# Altium project RTC_Breakout_SP24.PrjPcb
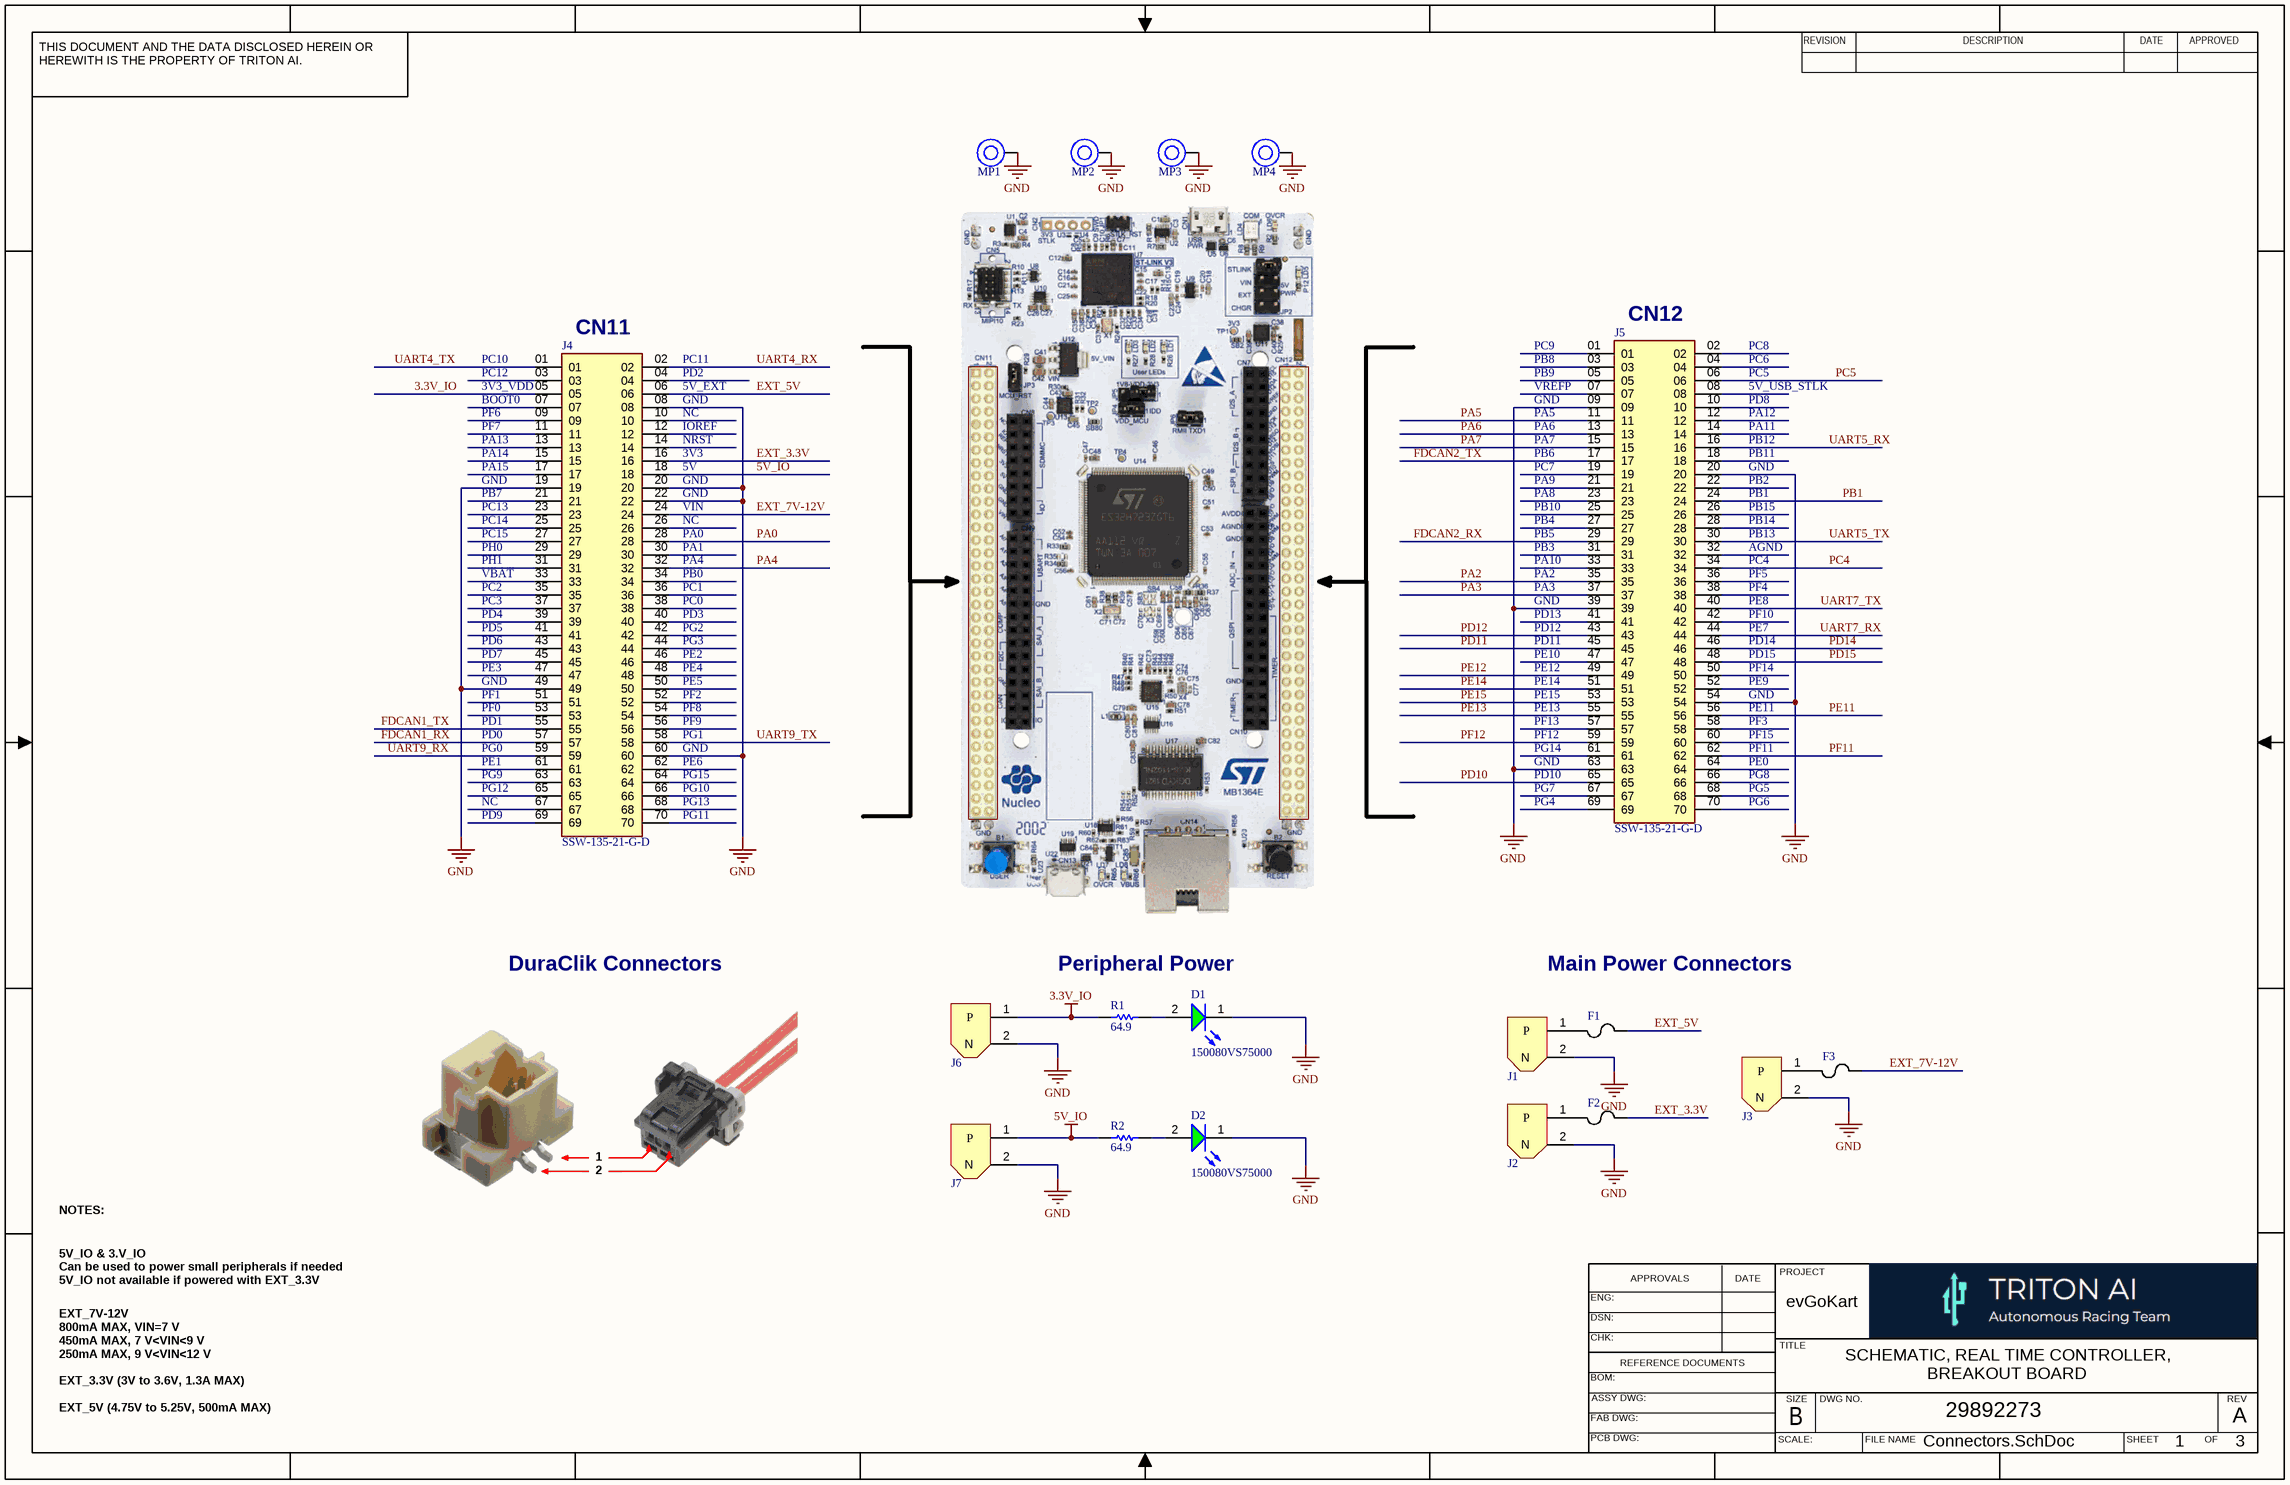
[diagram p0: Connectors.SchDoc]
3 sheets, 106 parts. Net scope: global (net labels, ports and power ports of the same name join across sheets).
Board file: RTC_Breakout_SP24.PcbDoc
Sheets:
  Connectors.SchDoc
  CAN_RS232.SchDoc
  I-O Connectors.SchDoc

## Sheet Connectors.SchDoc
size 431 x 279 mm; DrawnBy: Frank Chaqueco; Organization: ORGANIZATION; Address1: ADDRESS 1; Address2: ADDRESS 2; Address3: ADDRESS 3; Address4: ADDRESS 4; Revision: -; SheetNumber: 1; SheetTotal: 3; ENG_APP_DATE: --/--/--; DSN_APP_DATE: --/--/--; CHK_APP_DATE: --/--/--

### Parts
D1  150080VS75000  [WL-SMCW_0805_150080xx75000]
D2  150080VS75000  [WL-SMCW_0805_150080xx75000]
F1  500mA  [FUS_VISHAY_MFU0805_VIS]  (value not drawn)
F2  1.5A  [FUS_VISHAY_MFU0805_VIS]  (value not drawn)
F3  800mA  [FUS_VISHAY_MFU0805_VIS]  (value not drawn)
J1  XT30UPB-M  [XT30UPB-M]  (value not drawn)
J2  XT30UPB-M  [XT30UPB-M]  (value not drawn)
J3  XT30UPB-M  [XT30UPB-M]  (value not drawn)
J4  SSW-135-21-G-D  [SAMTEC_SSW-135-21-G-D]
J5  SSW-135-21-G-D  [SAMTEC_SSW-135-21-G-D]
J6  XT30UPB-M  [XT30UPB-M]  (value not drawn)
J7  XT30UPB-M  [XT30UPB-M]  (value not drawn)
MP1  M2.5 x 9mm  [9774090151]  (value not drawn)
MP2  M2.5 x 9mm  [9774090151]  (value not drawn)
MP3  M2.5 x 9mm  [9774090151]  (value not drawn)
MP4  M2.5 x 9mm  [9774090151]  (value not drawn)
R1  64.9  [RESC2013X60X35LL10T20]
R2  64.9  [RESC2013X60X35LL10T20]

### Nets
3.3V_IO: J4.05 J6.1(P) R1.2
5V_IO: J4.18 J7.1(P) R2.2
GND: D1.1(K) D2.1(K) J1.2(N) J2.2(N) J3.2(N) J4.08 J4.19 J4.20 J4.22 J4.49 J4.60 J5.09 J5.20 J5.39 J5.54 J5.63 J6.2(N) J7.2(N) MP1.1 MP2.1 MP3.1 MP4.1
EXT_3.3V: F2.1 J4.16
EXT_5V: F1.1 J4.06
EXT_7V-12V: F3.1 J4.24
FDCAN1_RX: J4.57
FDCAN1_TX: J4.55
FDCAN2_RX: J5.29
FDCAN2_TX: J5.17
PA0: J4.28
PA2: J5.35
PA3: J5.37
PA4: J4.32
PA5: J5.11
PA6: J5.13
PA7: J5.15
PB1: J5.24
PC4: J5.34
PC5: J5.06
PD10: J5.65
PD11: J5.45
PD12: J5.43
PD14: J5.46
PD15: J5.48
PE11: J5.56
PE12: J5.49
PE13: J5.55
PE14: J5.51
PE15: J5.53
PF11: J5.62
PF12: J5.59
UART4_RX: J4.02
UART4_TX: J4.01
UART5_RX: J5.16
UART5_TX: J5.30
UART7_RX: J5.44
UART7_TX: J5.40
UART9_RX: J4.59
UART9_TX: J4.58
NetD1_2: D1.2(A) R1.1
NetD2_2: D2.2(A) R2.1
NetF1_2: F1.2 J1.1(P)
NetF2_2: F2.2 J2.1(P)
NetF3_2: F3.2 J3.1(P)

Not connected (* = marked no-connect by the designer): J4 03 04 07 09 10 11 12 13 14 15 17 21 23 25 26 27 29 30 31 33 34 35 36 37 38 39 40 41 42 43 44 45 46 47 48 50 51 52 53 54 56 61 62 63 64 65 66 67 68 69 70; J5 01 02 03 04 05 07 08 10 12 14 18 19 21 22 23 25 26 27 28 31 32 33 36 38 41 42 47 50 52 57 58 60 61 64 66 67 68 69 70

### Notes on the sheet
- PC10
- (near J4) CN11
- (near J4) PC11
- PC9
- PB8
- (near J5) CN12
- PC8
- PC6
- PC12
- (near J4) 3V3_VDD
- (near J4) BOOT0
- PF6
- PF7
- (near J4) PD2
- (near J4) 5V_EXT
- (near J4) GND
- (near J4) NC
- (near J4) IOREF
- PB9
- (near J5) VREFP
- GND
- PA5
- PA6
- PC5
- 5V_USB_STLK
- PD8
- PA12
- PA11
- PA13
- PA14
- PA15
- PB7
- (near J4) NRST
- (near J4) 3V3
- (near J4) 5V
- PA7
- PB6
- PC7
- PA9
- PA8
- PB12
- PB11
- PB2
- PB1
- PC13
- PC14
- PC15
- PH0
- PH1
- (near J4) VIN
- (near J4) PA0
- (near J4) PA1
- (near J4) PA4
- PB10
- PB4
- PB5
- PB3
- PA10
- PB15
- PB14
- PB13
- AGND
- PC4
- VBAT
- PC2
- PC3
- PD4
- PD5
- (near J4) PB0
- (near J4) PC1
- (near J4) PC0
- (near J4) PD3
- (near J4) PG2
- PA2
- PA3
- PD13
- PD12
- PF5
- PF4
- PE8
- PF10
- PE7
- PD6
- PD7
- PE3
- PF1
- (near J4) PG3
- (near J4) PE2
- (near J4) PE4
- (near J4) PE5
- (near J4) PF2
- PD11
- PE10
- PE12
- PE14
- PE15
- PD14
- PD15
- PF14
- PE9
- PF0
- PG0
- PE1
- PD1
- PD0
- (near J4) PF8
- (near J4) PF9
- (near J4) PG1
- (near J4) PE6
- PE13
- PF13
- PF12
- PG14
- PE11
- PF3
- PF15
- PF11
- PE0
- PG9
- PG12
- NC
- PD9
- (near J4) PG15
- (near J4) PG10
- (near J4) PG13
- (near J4) PG11
- PD10
- PG7
- PG4
- PG8
- PG5
- PG6
- DuraClik Connectors
- Peripheral Power
- Main Power Connectors
- 1
- NOTES:
- 2
- 5V_IO & 3.V_IO
  Can be used to power small peripherals if needed
  5V_IO not available if powered with EXT_3.3V
- evGoKart
- SCHEMATIC, REAL TIME CONTROLLER,
- EXT_7V-12V
  800mA MAX, VIN=7 V
  450mA MAX, 7 V<VIN<9 V
  250mA MAX, 9 V<VIN<12 V
  EXT_3.3V (3V to 3.6V, 1.3A MAX)
  EXT_5V (4.75V to 5.25V, 500mA MAX)
- BREAKOUT BOARD
- 29892273
- A
- Connectors.SchDoc
- 3
- THIS DOCUMENT AND THE DATA DISCLOSED HEREIN OR HEREWITH IS THE PROPERTY OF TRITON AI.
- REVISION
- DESCRIPTION
- DATE
- APPROVED
- ENG:
- APPROVALS
- PROJECT
- DSN:
- CHK:
- REFERENCE DOCUMENTS
- TITLE
- BOM:
- FAB DWG:
- PCB DWG:
- ASSY DWG:
- SCALE:
- SIZE
- B
- DWG NO.
- FILE NAME
- SHEET
- OF
- REV

### Library data of the parts
D1 D2 = CMP-1426-00009-6: WL-SMCW SMT Mono-Color Chip LED Waterclear; Max Junction Temperature (Tj): 95°C; Max Reverse Voltage (DC): 5V; Luminous Intensity: 40mcd; Color: Green; Peak Wavelength: 572nm; Wavelength: 570nm; Viewing Angle: 140°; Power Dissipation: 72mW; Forward Current: 100mA; Test Current: 20mA; Forward Voltage: 2V; Lens Style: Clear, Rectangular; Reverse Voltage: 5V; Length: 2mm; RoHS: Compliant; Min Operating Temperature: -40°C; REACH SVHC: Unknown; Packaging: Tape and Reel; Case/Package: 0805; Max Operating Temperature: 85°C; Case Code (Metric): 2012; Width: 1.25mm; Dominant Wavelength: 570nm; Mount: Surface Mount; Case Code (Imperial): 0805; Height: 700µm
F1 = MFU0805FF00500P500: Mfr_Name: Vishay; Current Rating: 500mA
F2 = MFU0805FF01500P100: Mfr_Name: Vishay; Current Rating: 1.5A
F3 = MFU0805FF00800P100: Mfr_Name: Vishay; Current Rating: 800mA
J1-J3 J6 J7 = XT30UPB-M: Socket; DC supply; XT30; male; PIN: 2; on PCBs; THT; yellow; 15A; 500V; MF: amass; MP: XT30UPB-M; Value: *; SnapEDA_Link: https://www.snapeda.com/parts/XT30UPB-M/AMASS/view-part/?ref=snap; Price: None; Package: None; Check_prices: https://www.snapeda.com/parts/XT30UPB-M/AMASS/view-part/?ref=eda; Availability: Not in stock
J4 J5 = SSW-135-21-G-D: MF: {'manufacturer': u'Samtec Inc.'}; Package: None; Price: None; Value: *; MP: SSW-135-21-G-D; Availability: Unavailable
MP1-MP4 = 9774090151R: WA-SMSI SMT Steel Spacer with internal Thread, OD 5.1mm, M2.5 x 9mm; Manufacturer: Wurth Elektronik; Inside Diameter: 3.5mm; Surface: Tin; ComponentLink1Description: Website Link; ComponentLink1URL: https://www.we-online.com/redexpert/article/9774090151R?ad; ComponentLink2Description: Datasheet Link; ComponentLink2URL: https://www.we-online.com/redexpert/spec/9774090151R?ad; Manufacturer Part Number: 9774090151R; Category: SMT Spacers; Match Code: WA-SMSI; Mount: Surface Mount; Operating Temperature Max: 150°C; Operating Temperature Min: -55°C; Packaging: Tape and Reel; Height: 9mm; Material: Steel; Outside Diameter: 5.1mm; Thread Size: M2.5
R1 R2 = CMP-2001-01223-1: Part Number: RC0805FR-0764R9L; Manufacturer: Yageo

## Sheet CAN_RS232.SchDoc
size 431 x 279 mm; SheetNumber: 2; SheetTotal: 3
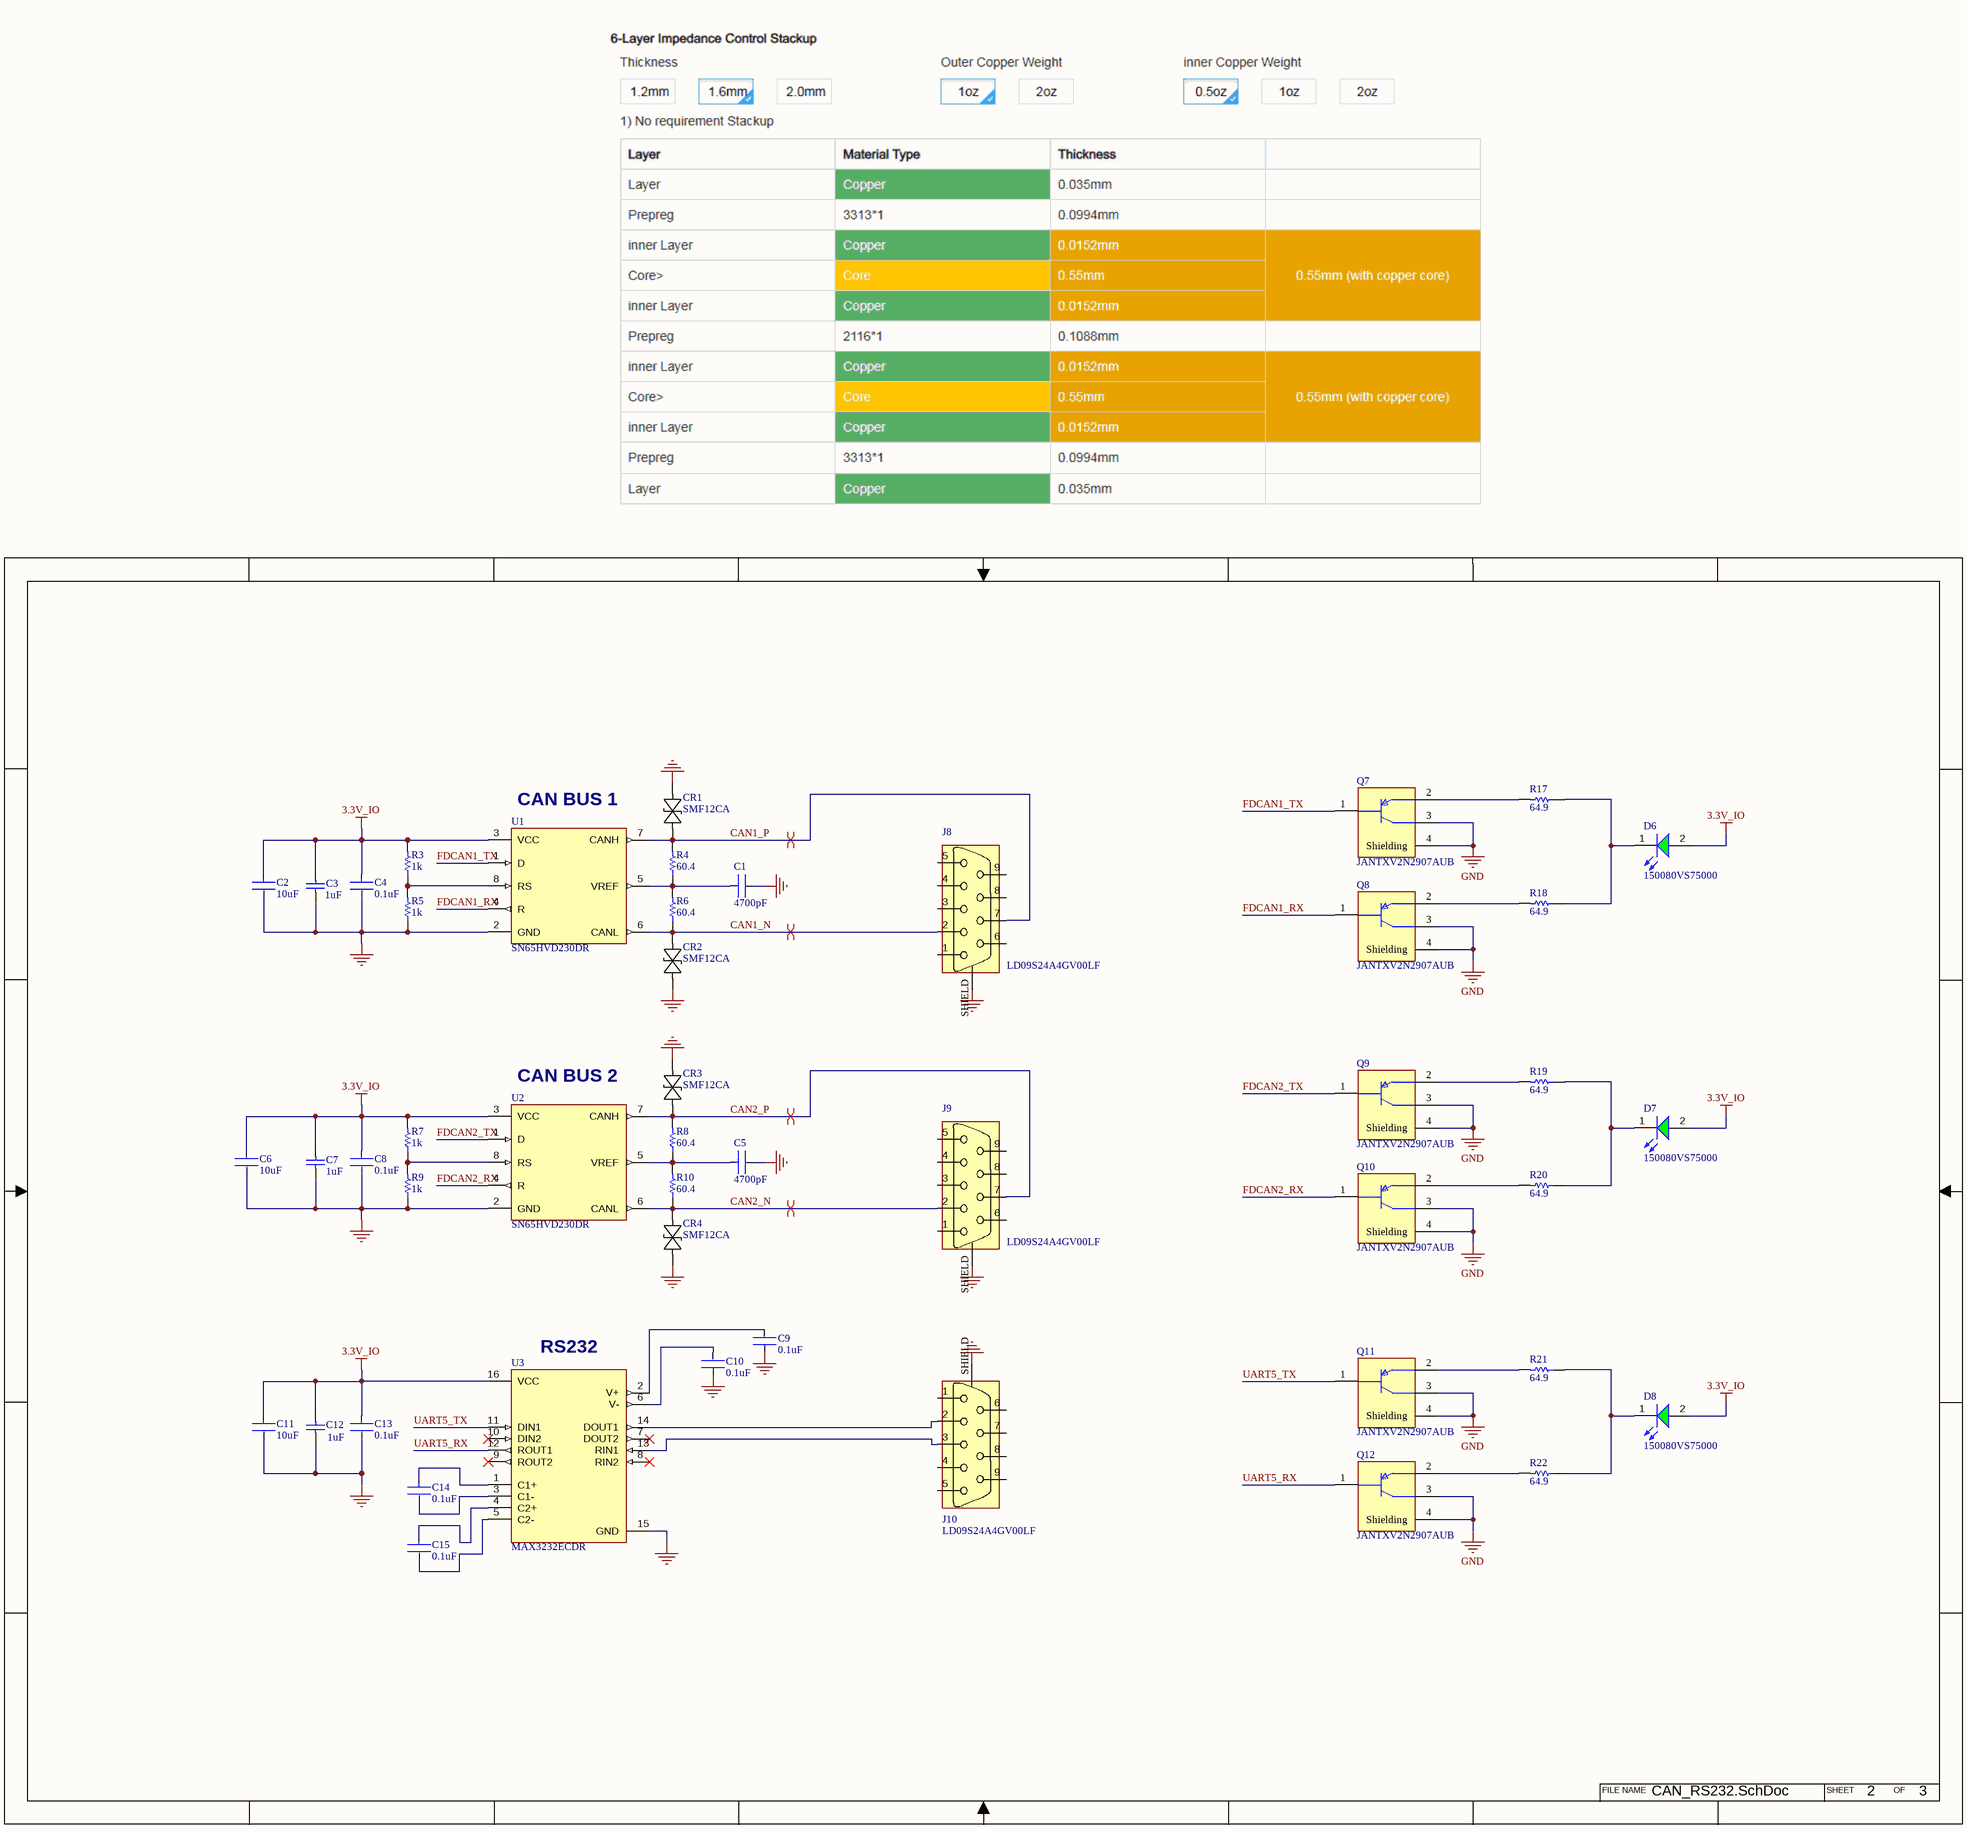
[diagram p1: CAN_RS232.SchDoc]

### Parts
C1  4700pF  [FP-CC0805-0_85-MFG]
C2  10uF  [FP-CL31-IPC_B]
C3  1uF  [CAPC2013X100X50ML20T25]
C4  0.1uF  [FP-CC0805-0_85-MFG]
C5  4700pF  [FP-CC0805-0_85-MFG]
C6  10uF  [FP-CL31-IPC_B]
C7  1uF  [CAPC2013X100X50ML20T25]
C8  0.1uF  [FP-CC0805-0_85-MFG]
C9  0.1uF  [FP-CC0805-0_85-MFG]
C10  0.1uF  [FP-CC0805-0_85-MFG]
C11  10uF  [FP-CL31-IPC_B]
C12  1uF  [CAPC2013X100X50ML20T25]
C13  0.1uF  [FP-CC0805-0_85-MFG]
C14  0.1uF  [FP-CC0805-0_85-MFG]
C15  0.1uF  [FP-CC0805-0_85-MFG]
CR1  SMF12CA  [SOD-123F_LTF]
CR2  SMF12CA  [SOD-123F_LTF]
CR3  SMF12CA  [SOD-123F_LTF]
CR4  SMF12CA  [SOD-123F_LTF]
D6  150080VS75000  [WL-SMCW_0805_150080xx75000]
D7  150080VS75000  [WL-SMCW_0805_150080xx75000]
D8  150080VS75000  [WL-SMCW_0805_150080xx75000]
J8  LD09S24A4GV00LF  [ASSMANN_A-DF09A/KG-T2S]
J9  LD09S24A4GV00LF  [ASSMANN_A-DF09A/KG-T2S]
J10  LD09S24A4GV00LF  [ASSMANN_A-DF09A/KG-T2S]
Q7  JANTXV2N2907AUB  [FP-UB-IPC_C]
Q8  JANTXV2N2907AUB  [FP-UB-IPC_C]
Q9  JANTXV2N2907AUB  [FP-UB-IPC_C]
Q10  JANTXV2N2907AUB  [FP-UB-IPC_C]
Q11  JANTXV2N2907AUB  [FP-UB-IPC_C]
Q12  JANTXV2N2907AUB  [FP-UB-IPC_C]
R3  1k  [RESC2013X60X35ML10T20]
R4  60.4  [RESC2013X60X35LL10T20]
R5  1k  [RESC2013X60X35ML10T20]
R6  60.4  [RESC2013X60X35LL10T20]
R7  1k  [RESC2013X60X35ML10T20]
R8  60.4  [RESC2013X60X35LL10T20]
R9  1k  [RESC2013X60X35ML10T20]
R10  60.4  [RESC2013X60X35LL10T20]
R17  64.9  [RESC2013X60X35LL10T20]
R18  64.9  [RESC2013X60X35LL10T20]
R19  64.9  [RESC2013X60X35LL10T20]
R20  64.9  [RESC2013X60X35LL10T20]
R21  64.9  [RESC2013X60X35LL10T20]
R22  64.9  [RESC2013X60X35LL10T20]
U1  SN65HVD230DR  [SOIC127P599X175-8N]
U2  SN65HVD230DR  [SOIC127P599X175-8N]
U3  MAX3232ECDR  [SOIC127P600X175-16N]

### Nets
3.3V_IO: C2.1 C3.2 C4.1 C6.1 C7.2 C8.1 C11.1 C12.2 C13.1 D6.2(A) D7.2(A) D8.2(A) R3.2 R7.2 U1.3(VCC) U2.3(VCC) U3.16(VCC)
GND: C1.2 C2.2 C3.1 C4.2 C5.2 C6.2 C7.1 C8.2 C9.1 C10.1 C11.2 C12.1 C13.2 CR1.1 CR2.1 CR3.2 CR4.2 J8.SHIELD J9.SHIELD J10.SHIELD Q7.3(C) Q7.4(Shielding) Q8.3(C) Q8.4(Shielding) Q9.3(C) Q9.4(Shielding) Q10.3(C) Q10.4(Shielding) Q11.3(C) Q11.4(Shielding) Q12.3(C) Q12.4(Shielding) R5.1 R9.1 U1.2(GND) U2.2(GND) U3.15(GND)
CAN1_N: CR2.2 J8.2 R6.1 U1.6(CANL)
CAN1_P: CR1.2 J8.7 R4.2 U1.7(CANH)
CAN2_N: CR4.1 J9.2 R10.1 U2.6(CANL)
CAN2_P: CR3.1 J9.7 R8.2 U2.7(CANH)
FDCAN1_RX: Q8.1(B) U1.4(R)
FDCAN1_TX: Q7.1(B) U1.1(D)
FDCAN2_RX: Q10.1(B) U2.4(R)
FDCAN2_TX: Q9.1(B) U2.1(D)
UART5_RX: Q12.1(B) U3.12(ROUT1)
UART5_TX: Q11.1(B) U3.11(DIN1)
NetC1_1: C1.1 R4.1 R6.2 U1.5(VREF)
NetC5_1: C5.1 R8.1 R10.2 U2.5(VREF)
NetC9_2: C9.2 U3.2(V+)
NetC10_2: C10.2 U3.6(V-)
NetC14_1: C14.1 U3.1(C1+)
NetC14_2: C14.2 U3.3(C1-)
NetC15_1: C15.1 U3.4(C2+)
NetC15_2: C15.2 U3.5(C2-)
NetD6_1: D6.1(K) R17.1 R18.1
NetD7_1: D7.1(K) R19.1 R20.1
NetD8_1: D8.1(K) R21.1 R22.1
NetJ10_2: J10.2 U3.14(DOUT1)
NetJ10_3: J10.3 U3.13(RIN1)
NetQ7_2: Q7.2(E) R17.2
NetQ8_2: Q8.2(E) R18.2
NetQ9_2: Q9.2(E) R19.2
NetQ10_2: Q10.2(E) R20.2
NetQ11_2: Q11.2(E) R21.2
NetQ12_2: Q12.2(E) R22.2
NetR3_1: R3.1 R5.2 U1.8(RS)
NetR7_1: R7.1 R9.2 U2.8(RS)

Not connected (* = marked no-connect by the designer): J8 1 3 4 5 6 8 9; J9 1 3 4 5 6 8 9; J10 1 4 5 6 7 8 9; U3 7(DOUT2)* 8(RIN2)* 9(ROUT2)* 10(DIN2)*

### Layout directives
differential pair: CAN1_N, CAN1_P, CAN2_N, CAN2_P

### Notes on the sheet
- (near U1) CAN BUS 1
- (near U2) CAN BUS 2
- (near U3) RS232
- CAN_RS232.SchDoc
- 2
- 3
- FILE NAME
- SHEET
- OF

### Library data of the parts
C1 C5 = CMP-1036-03591-2: CAP CER 4700PF 50V X7R 0805; Manufacturer: Yageo; Manufacturer Part Number: CC0805KRX7R9BB472; Tolerance: 0.1; Capacitance: 4.7 nF; Value: 4.7 nF; Material: Ceramic; Device Class L1: Passive Components; Voltage Rating: 50 V; ComponentLink2URL: http://www.yageo.com/documents/recent/UPY-GPHC_Y5V_6.3V-to-50V_8.pdf; Device Class L3: Ceramic Capacitors; Temperature: -30°C to +85°C; Height: 0.95mm; Package: CC0805-0.85; Digikey Description: CAP CER 4700PF 50V X7R 0805; Ipc Land Pattern Name: CAPC200125X85; Device Class L2: Capacitors; Temperature Range High: +85°C; Mouser Description: Multilayer Ceramic Capacitors MLCC - SMD/SMT 4.7nF 50V X7R 10%; Lead Free: Yes; Category: Cap; Temperature Range Low: -30°C; Octopart: https://octopart.com/cc0805krx7r9bb472-yageo-192986; Automotive: No; RoHS: TRUE; Temperature Characteristic: X7R; ComponentLink2Description: Datasheet; Footprint Url: http://www.yageo.com/exep/pages/download/literatures/UPY-C_GEN_24.pdf
C2 C6 C11 = CMP-13271-001434-1: Cap Ceramic 10uF 25V X7R ±10% SMD 1206 +125°C Embossed T/R; Max Operating Temperature: 125°C; Dielectric: X7R; Voltage Rating: 25V; Tolerance: 10%; Min Operating Temperature: -55°C; Height: 1.6mm; Mount: Surface Mount; Width: 0.063inch; Thickness: 0.071inch; Case Code (Metric): 3216; Contact Plating: Tin; Packaging: Tape and Reel; Case/Package: 1206; Value: 10uF; Case Code (Imperial): 1206; Length: 0.126inch; Radiation Hardening: No; Package Quantity: 1; Depth: 1.6mm
C3 = CMP-2007-03676-1: C0805C105K8RACTU; Manufacturer: Kemet; Part Number: C0805C105K8RACTU
C4 C8-C10 C13-C15 = CMP-2100-03606-3: CAP CER 0.1UF 50V X7R 0805; Manufacturer Part Number: CC0805KRX7R9BB104; Manufacturer: Yageo; Tolerance: 0.1; Capacitance: 100 nF; Value: 100 nF; Material: Ceramic; Device Class L1: Passive Components; ComponentLink2Description: Datasheet; Package: CC0805-0.85; Digikey Description: CAP CER 0.1UF 50V X7R 0805; Device Class L3: Ceramic Capacitors; Temperature: -30°C to +85°C; Temperature Characteristic: X7R; Voltage Rating: 50 V; Height: 0.95mm; RoHS: TRUE; Ipc Land Pattern Name: CAPC200125X85; Device Class L2: Capacitors; Category: Cap; Temperature Range Low: -30°C; Temperature Range High: +85°C; Mouser Description: Multilayer Ceramic Capacitors MLCC - SMD/SMT 100nF 50V X7R 10%; Footprint Url: http://www.yageo.com/exep/pages/download/literatures/UPY-C_GEN_24.pdf; Automotive: No; Octopart: https://octopart.com/cc0805krx7r9bb104-yageo-192993; Lead Free: Yes; ComponentLink2URL: http://www.yageo.com/documents/recent/UPY-GPHC_Y5V_6.3V-to-50V_8.pdf
C7 C12 = CMP-2007-03676-1: Part Number: C0805C105K8RACTU; Manufacturer: Kemet
CR1-CR4 = SMF12CA: No Description Available; Mfr_Name: Littelfuse Inc
D6-D8 = CMP-1426-00009-6: as D1 on sheet Connectors; Reverse Voltage: 5V; Length: 2mm; RoHS: Compliant; Min Operating Temperature: -40°C; REACH SVHC: Unknown; Packaging: Tape and Reel; Case/Package: 0805; Max Operating Temperature: 85°C; Case Code (Metric): 2012; Width: 1.25mm; Dominant Wavelength: 570nm; Mount: Surface Mount; Case Code (Imperial): 0805; Height: 700µm
J8-J10 = LD09S24A4GV00LF: No Description Available; Mfr_Name: Amphenol ICC; Type: D-Sub Connector Assemblies; RefDes: RefDes
Q7-Q12 = CMP-06366-000007-1: TRANS PNP 60V 0.6A 4UB
R3 R5 R7 R9 = CMP-2100-03671-1: Chip Resistor, 1 KOhm, +/- 1%, 125 mW, -55 to 155 degC, 0805 (2012 Metric), RoHS, Tape and Reel; Manufacturer: Yageo; Temperature Coefficient: 100ppm/degreesC; Voltage Rating (DC): 150V; Max Power Dissipation: 125mW; Resistance: 1KOhm; Number of Pins: 2; Number of Terminations: 2; Datasheet URL: http://www.yageo.com/NewPortal/yageodocoutput?fileName=/pdf/R-Chip/PYu-RC_Group_51_RoHS_L_5.pdf; Length: 0.079inch; Package Description: 2-Pin Surface Mounted Device, Body 2 x 1.25 mm; Depth: 1.25mm; Height: 0.024inch; Military Standard: Not; Case/Package: 0805; Package Reference: 0805; RoHSCompliant: true; Lead Free: LeadFree; Packaging: TapeandReel; Package Quantity: 1; Datasheet Version: Rev. 5, 10/2016; Tolerance: 1%; Min Operating Temperature: -55degC; Voltage Rating: 150V; Composition: ThickFilm; Case Code (Imperial): 0805; Power Rating: 125mW; Width: 0.049inch; Case Code (Metric): 2012; Manufacturer URL: http://www.yageo.com/; Max Operating Temperature: 155degC; REACH SVHC: Unknown; Termination: SMD/SMT
R4 R6 R8 R10 = CMP-2001-01223-1: Part Number: RC0805FR-0760R4L; Manufacturer: Yageo
R17-R22 = CMP-2001-01223-1: as R1 on sheet Connectors
U1 U2 = SN65HVD230DR: 3.3 V CAN Transceiver with Standby Mode 8-SOIC -40 to 85; MF: Texas Instruments; Package: SOIC-8 Texas Instruments; DigiKey-Purchase-URL: https://snapeda.com/shop?store=DigiKey&id=51767; MP: SN65HVD230DR; Mouser-Purchase-URL: https://snapeda.com/shop?store=Mouser&id=51767; Value: *; Arrow_Electronics-Purchase-URL: https://snapeda.com/shop?store=Arrow+Electronics&id=51767; Availability: Good; SnapEDA_Link: https://www.snapeda.com/parts/SN65HVD230DR/Texas%20Instruments/view-part/51767/?ref=snap; Price: None; Texas_Instruments-Purchase-URL: https://snapeda.com/shop?store=Texas+Instruments&id=51767
U3 = MAX3232ECDR: 3-V to 5.5-V multichannel RS-232 line driver and receiver with 15-kV IEC ESD protection 16-SOIC 0 to 70; Price: None; MP: MAX3232ECDR; Availability: Unavailable; Package: None; Value: *

## Sheet I-O Connectors.SchDoc
size 431 x 279 mm; SheetNumber: 3; SheetTotal: 3
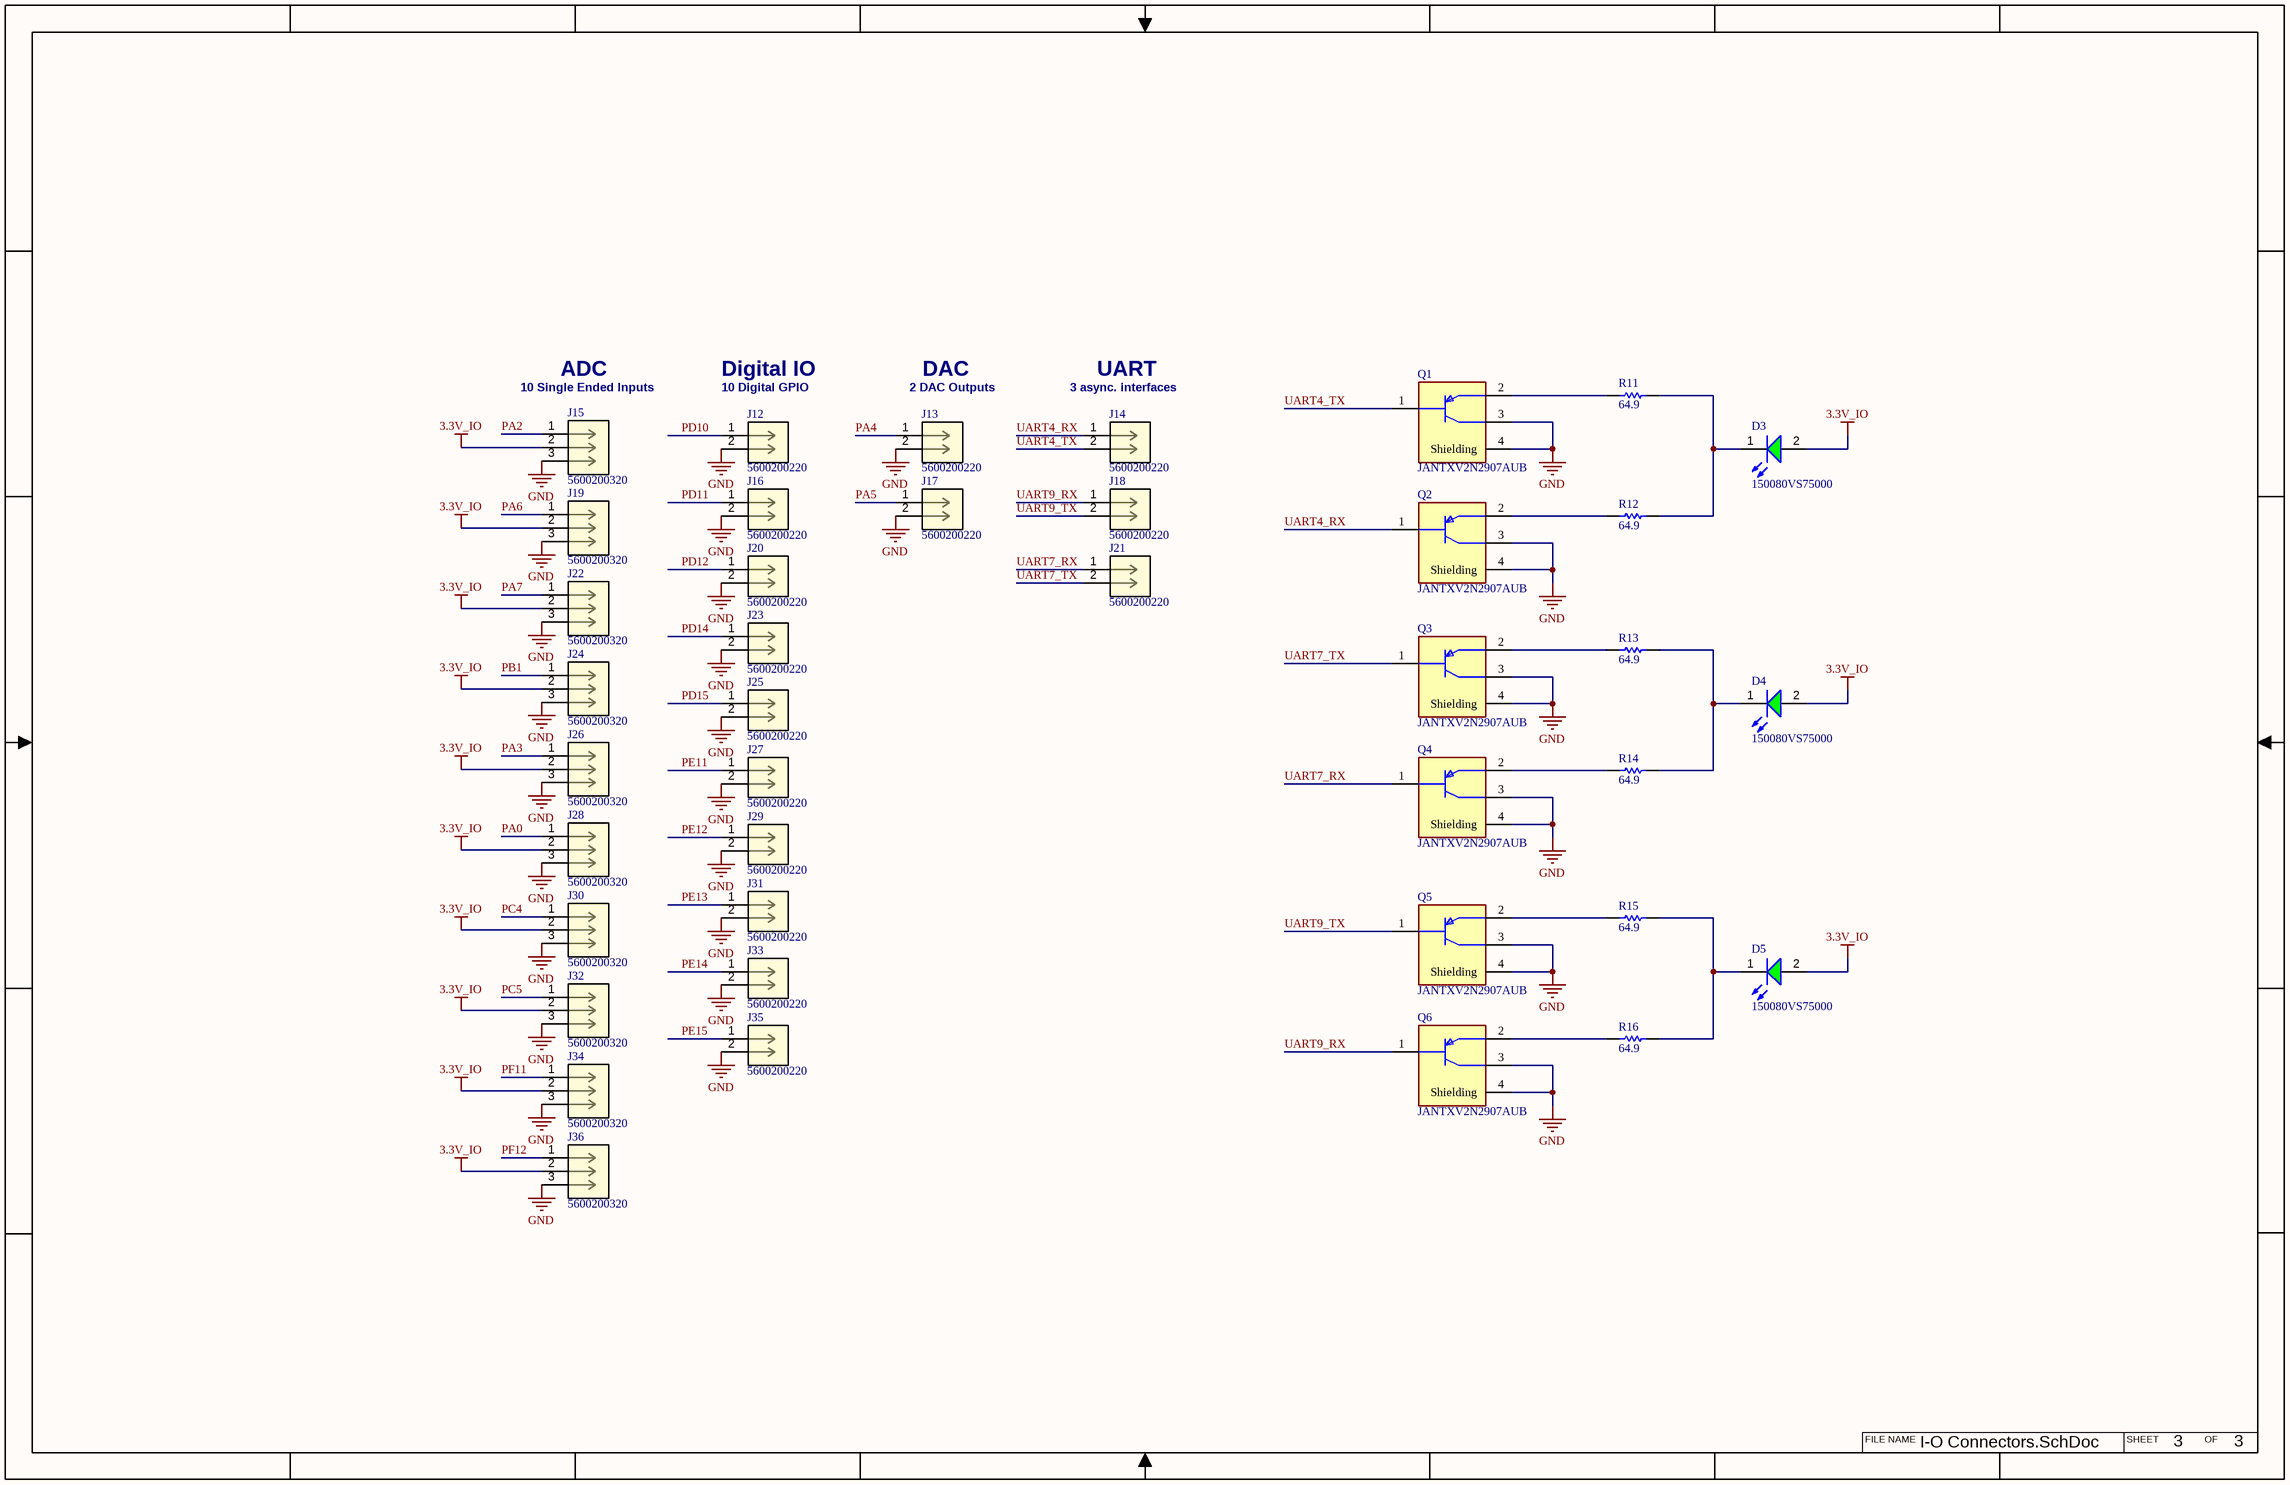
[diagram p2: I-O Connectors.SchDoc]

### Parts
D3  150080VS75000  [WL-SMCW_0805_150080xx75000]
D4  150080VS75000  [WL-SMCW_0805_150080xx75000]
D5  150080VS75000  [WL-SMCW_0805_150080xx75000]
J12  5600200220  [CONN_5600200220_MOL]
J13  5600200220  [CONN_5600200220_MOL]
J14  5600200220  [CONN_5600200220_MOL]
J15  5600200320  [CONN03_560020_MOL]
J16  5600200220  [CONN_5600200220_MOL]
J17  5600200220  [CONN_5600200220_MOL]
J18  5600200220  [CONN_5600200220_MOL]
J19  5600200320  [CONN03_560020_MOL]
J20  5600200220  [CONN_5600200220_MOL]
J21  5600200220  [CONN_5600200220_MOL]
J22  5600200320  [CONN03_560020_MOL]
J23  5600200220  [CONN_5600200220_MOL]
J24  5600200320  [CONN03_560020_MOL]
J25  5600200220  [CONN_5600200220_MOL]
J26  5600200320  [CONN03_560020_MOL]
J27  5600200220  [CONN_5600200220_MOL]
J28  5600200320  [CONN03_560020_MOL]
J29  5600200220  [CONN_5600200220_MOL]
J30  5600200320  [CONN03_560020_MOL]
J31  5600200220  [CONN_5600200220_MOL]
J32  5600200320  [CONN03_560020_MOL]
J33  5600200220  [CONN_5600200220_MOL]
J34  5600200320  [CONN03_560020_MOL]
J35  5600200220  [CONN_5600200220_MOL]
J36  5600200320  [CONN03_560020_MOL]
Q1  JANTXV2N2907AUB  [FP-UB-IPC_C]
Q2  JANTXV2N2907AUB  [FP-UB-IPC_C]
Q3  JANTXV2N2907AUB  [FP-UB-IPC_C]
Q4  JANTXV2N2907AUB  [FP-UB-IPC_C]
Q5  JANTXV2N2907AUB  [FP-UB-IPC_C]
Q6  JANTXV2N2907AUB  [FP-UB-IPC_C]
R11  64.9  [RESC2013X60X35LL10T20]
R12  64.9  [RESC2013X60X35LL10T20]
R13  64.9  [RESC2013X60X35LL10T20]
R14  64.9  [RESC2013X60X35LL10T20]
R15  64.9  [RESC2013X60X35LL10T20]
R16  64.9  [RESC2013X60X35LL10T20]

### Nets
3.3V_IO: D3.2(A) D4.2(A) D5.2(A) J15.2 J19.2 J22.2 J24.2 J26.2 J28.2 J30.2 J32.2 J34.2 J36.2
GND: J12.2 J13.2 J15.3 J16.2 J17.2 J19.3 J20.2 J22.3 J23.2 J24.3 J25.2 J26.3 J27.2 J28.3 J29.2 J30.3 J31.2 J32.3 J33.2 J34.3 J35.2 J36.3 Q1.3(C) Q1.4(Shielding) Q2.3(C) Q2.4(Shielding) Q3.3(C) Q3.4(Shielding) Q4.3(C) Q4.4(Shielding) Q5.3(C) Q5.4(Shielding) Q6.3(C) Q6.4(Shielding)
PA0: J28.1
PA2: J15.1
PA3: J26.1
PA4: J13.1
PA5: J17.1
PA6: J19.1
PA7: J22.1
PB1: J24.1
PC4: J30.1
PC5: J32.1
PD10: J12.1
PD11: J16.1
PD12: J20.1
PD14: J23.1
PD15: J25.1
PE11: J27.1
PE12: J29.1
PE13: J31.1
PE14: J33.1
PE15: J35.1
PF11: J34.1
PF12: J36.1
UART4_RX: J14.1 Q2.1(B)
UART4_TX: J14.2 Q1.1(B)
UART7_RX: J21.1 Q4.1(B)
UART7_TX: J21.2 Q3.1(B)
UART9_RX: J18.1 Q6.1(B)
UART9_TX: J18.2 Q5.1(B)
NetD3_1: D3.1(K) R11.1 R12.1
NetD4_1: D4.1(K) R13.1 R14.1
NetD5_1: D5.1(K) R15.1 R16.1
NetQ1_2: Q1.2(E) R11.2
NetQ2_2: Q2.2(E) R12.2
NetQ3_2: Q3.2(E) R13.2
NetQ4_2: Q4.2(E) R14.2
NetQ5_2: Q5.2(E) R15.2
NetQ6_2: Q6.2(E) R16.2

### Notes on the sheet
- (near J15) 10 Single Ended Inputs
- (near J15) ADC
- Digital IO
- (near J12) 10 Digital GPIO
- (near J13) 2 DAC Outputs
- DAC
- (near J14) 3 async. interfaces
- UART
- I-O Connectors.SchDoc
- 3
- FILE NAME
- SHEET
- OF

### Library data of the parts
D3-D5 = CMP-1426-00009-6: as D1 on sheet Connectors; Reverse Voltage: 5V; Length: 2mm; RoHS: Compliant; Min Operating Temperature: -40°C; REACH SVHC: Unknown; Packaging: Tape and Reel; Case/Package: 0805; Max Operating Temperature: 85°C; Case Code (Metric): 2012; Width: 1.25mm; Dominant Wavelength: 570nm; Mount: Surface Mount; Case Code (Imperial): 0805; Height: 700µm
J12-J14 J16-J18 J20 J21 J23 J25 J27 J29 J31 J33 J35 = 5600200220: No Description Available; Mfr_Name: Molex Connector Corporation; RefDes: RefDes; Type: Type
J15 J19 J22 J24 J26 J28 J30 J32 J34 J36 = 5600200320: No Description Available; Mfr_Name: Molex Connector Corporation; RefDes: RefDes; Type: Type
Q1-Q6 = CMP-06366-000007-1: TRANS PNP 60V 0.6A 4UB
R11-R16 = CMP-2001-01223-1: as R1 on sheet Connectors

## Nets that join several sheets
3.3V_IO: Connectors (J4.05 J6.1 R1.2), CAN_RS232 (17 pins), I-O Connectors (13 pins)
GND: Connectors (22 pins), CAN_RS232 (37 pins), I-O Connectors (34 pins)
FDCAN1_RX: Connectors (J4.57), CAN_RS232 (Q8.1 U1.4)
FDCAN1_TX: Connectors (J4.55), CAN_RS232 (Q7.1 U1.1)
FDCAN2_RX: Connectors (J5.29), CAN_RS232 (Q10.1 U2.4)
FDCAN2_TX: Connectors (J5.17), CAN_RS232 (Q9.1 U2.1)
PA0: Connectors (J4.28), I-O Connectors (J28.1)
PA2: Connectors (J5.35), I-O Connectors (J15.1)
PA3: Connectors (J5.37), I-O Connectors (J26.1)
PA4: Connectors (J4.32), I-O Connectors (J13.1)
PA5: Connectors (J5.11), I-O Connectors (J17.1)
PA6: Connectors (J5.13), I-O Connectors (J19.1)
PA7: Connectors (J5.15), I-O Connectors (J22.1)
PB1: Connectors (J5.24), I-O Connectors (J24.1)
PC4: Connectors (J5.34), I-O Connectors (J30.1)
PC5: Connectors (J5.06), I-O Connectors (J32.1)
PD10: Connectors (J5.65), I-O Connectors (J12.1)
PD11: Connectors (J5.45), I-O Connectors (J16.1)
PD12: Connectors (J5.43), I-O Connectors (J20.1)
PD14: Connectors (J5.46), I-O Connectors (J23.1)
PD15: Connectors (J5.48), I-O Connectors (J25.1)
PE11: Connectors (J5.56), I-O Connectors (J27.1)
PE12: Connectors (J5.49), I-O Connectors (J29.1)
PE13: Connectors (J5.55), I-O Connectors (J31.1)
PE14: Connectors (J5.51), I-O Connectors (J33.1)
PE15: Connectors (J5.53), I-O Connectors (J35.1)
PF11: Connectors (J5.62), I-O Connectors (J34.1)
PF12: Connectors (J5.59), I-O Connectors (J36.1)
UART4_RX: Connectors (J4.02), I-O Connectors (J14.1 Q2.1)
UART4_TX: Connectors (J4.01), I-O Connectors (J14.2 Q1.1)
UART5_RX: Connectors (J5.16), CAN_RS232 (Q12.1 U3.12)
UART5_TX: Connectors (J5.30), CAN_RS232 (Q11.1 U3.11)
UART7_RX: Connectors (J5.44), I-O Connectors (J21.1 Q4.1)
UART7_TX: Connectors (J5.40), I-O Connectors (J21.2 Q3.1)
UART9_RX: Connectors (J4.59), I-O Connectors (J18.1 Q6.1)
UART9_TX: Connectors (J4.58), I-O Connectors (J18.2 Q5.1)